# EAGLE design current-sensor (EAGLE 7.1.0)
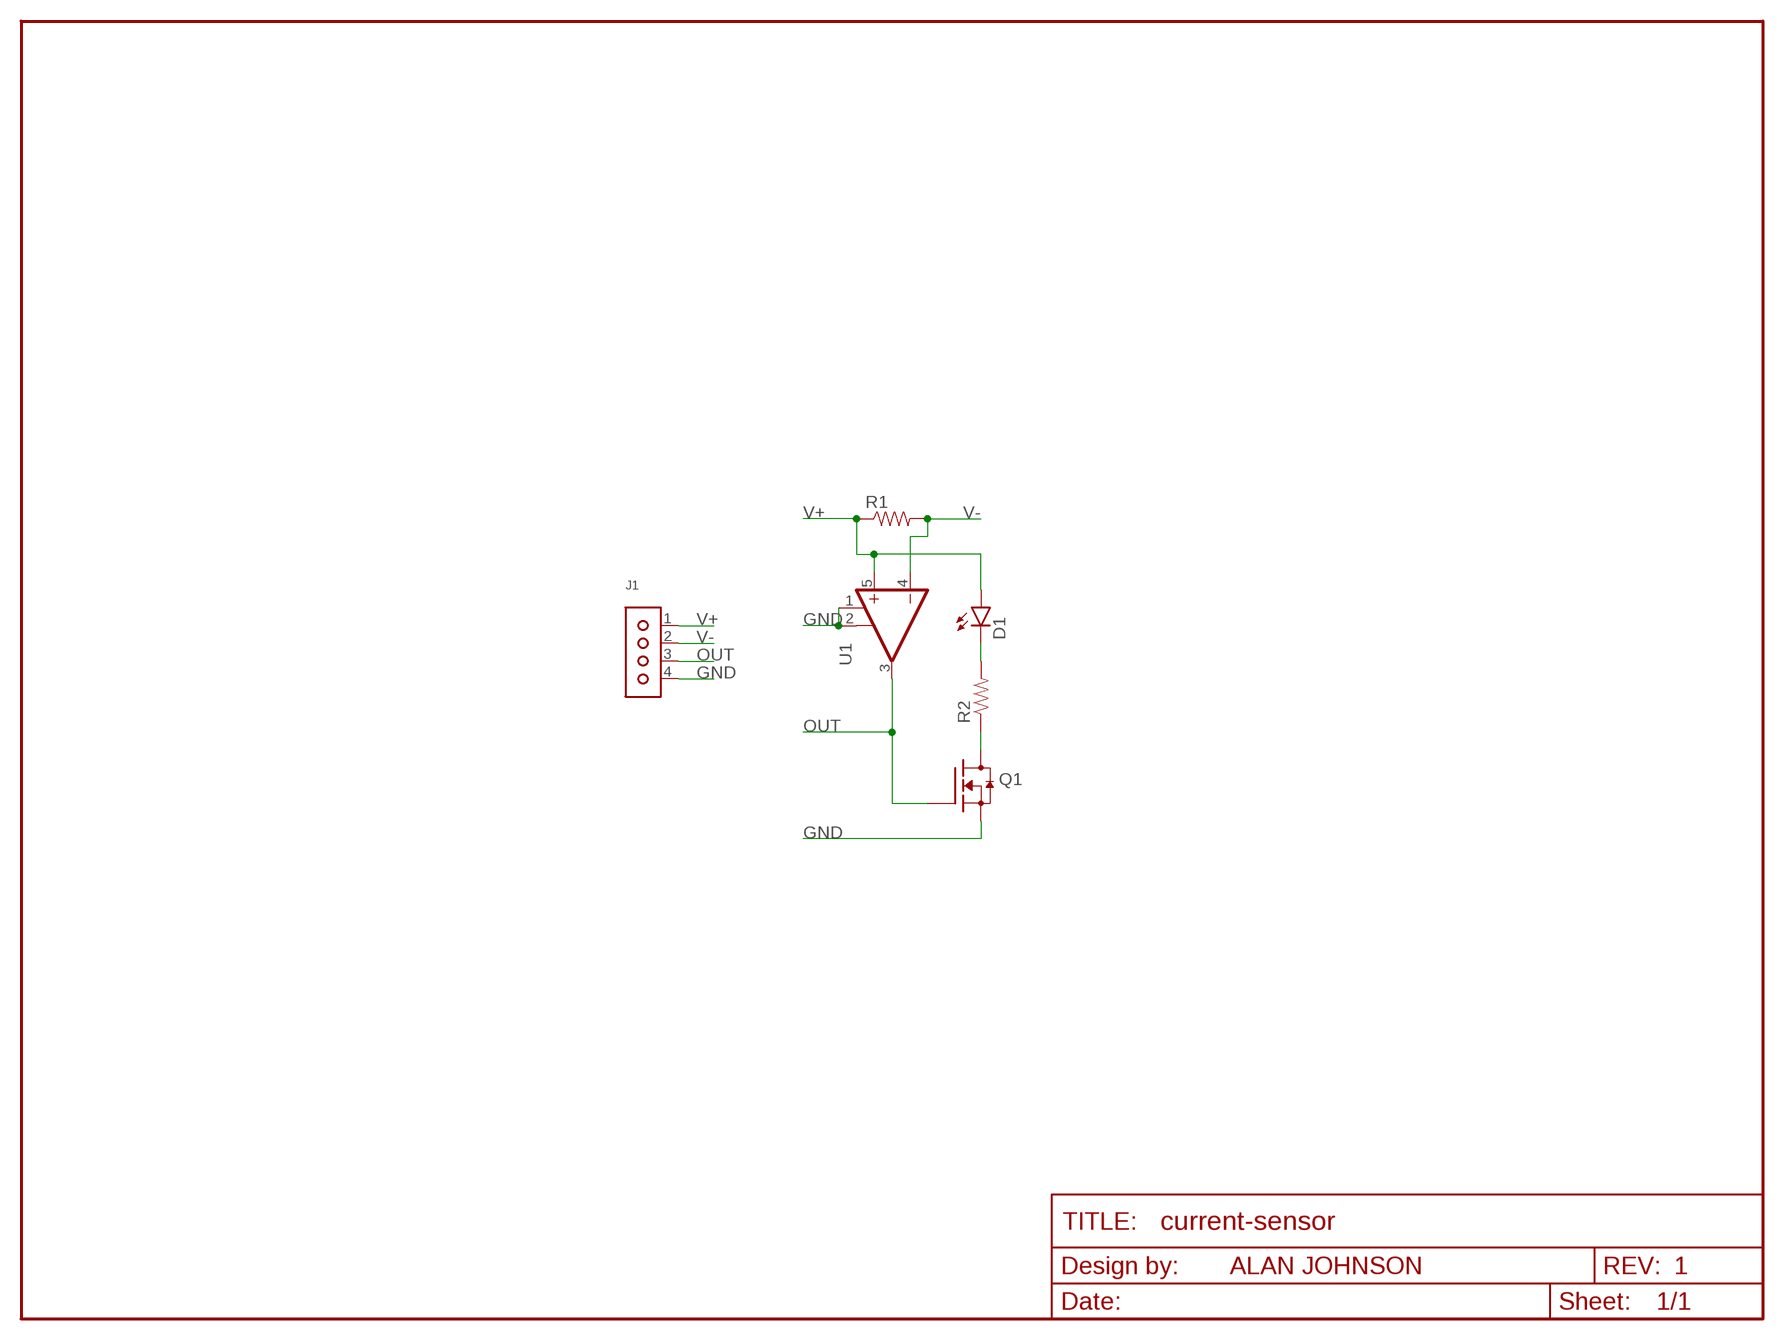
[diagram p0: schematic, sheet 1]

## Parts
D1  LED1206  [LED-1206]
J1  1X04  [1X04]
Q1  AO3416  [SOT23-3]
R1  RESISTOR0805  [0805]
R2  RESISTOR0805  [0805]
U1  TS1102  [SOT23-5]

## Nets
GND: J1.4 Q1.2(S) U1.1(GND) U1.2(GND)
N$2: Q1.3(D) R2.1
N$3: D1.C R2.2
OUT: J1.3 Q1.1(G) U1.3(OUT)
V+: D1.A J1.1 R1.1 U1.5(+IN)
V-: J1.2 R1.2 U1.4(-IN)

## Notes on the sheet
- ALAN JOHNSON | 1

## Library data of the parts
D1 = current-sensor:LED: LED
J1 = current-sensor:1X04: 1x04 Pin Headers
Q1 = current-sensor:AO3416: MOSFET - N Channel 20V Manufacturer Part Number AO3416 <http://aosmd.com/res/data_sheets/AO3416.pdf> DigiKey Part Number 785-1011-1-ND <http://www.digikey.com/product-detail/en/AO3416/785-1011-1-ND/1855953> Datasheet datasheets/AO3416.pdf
R1 R2 = current-sensor:RESISTOR: Resistor
U1 = current-sensor:TS1102: Current Sense OP-AMP Manufacturer Part Number TS1102-XX <http://www.silabs.com/Support%20Documents/TechnicalDocs/TS1102.pdf> DigiKey Part Number TS1102-25EG5TCT-ND <http://www.digikey.com/product-detail/en/TS1102-25EG5T/TS1102-25EG5TCT-ND/3674727> (gain=25) TS1102-50EG5TCT-ND <http://www.digikey.com/product-detail/en/TS1102-50EG5T/TS1102-50EG5TCT-ND/3674728> (gain=50) TS1102-100EG5TCT-ND <http://www.digikey.com/product-detail/en/TS1102-100EG5T/TS1102-100EG5TCT-ND/3674725> (gain=100) TS1102-200EG5TCT-ND <http://www.digikey.com/product-detail/en/TS1102-200EG5T/TS1102-200EG5TCT-ND/3674726> (gain=200) Datasheet datasheets/TS1102.pdf

## Board
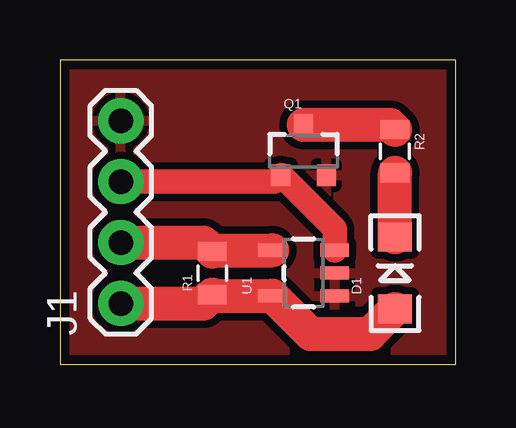
[diagram p1: board, top side]
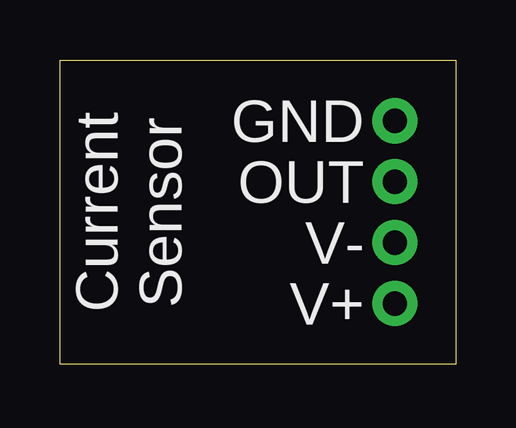
[diagram p2: board, bottom side, seen from below]

Size 16.51 x 12.7 mm. Coordinates in mm from the lower left corner, seen from the top.
Outline: 0,0 16.51,0 16.51,12.7 0,12.7 0,0
Copper layers (1*16): Top 0.0356mm / dielectric 1.5011mm / Bottom 0.0356mm
Design rules "current-sensor *": minimum track width 6mil, minimum drill 13mil, track to track 6mil, track to pad 6mil, pad to pad 6mil, via to via 6mil, smd to smd 6mil, copper to edge 15mil, drill to drill 6mil, minimum pad ring 7mil, minimum via ring 7mil, stop-mask expansion 3mil, vias tented up to drill 0mil, thermal gap 10mil

### Footprints (pad centres in the part's own frame; a part is rotated, then mirrored left to right if it is on the bottom)
LED-1206 = smd 1.2 x 1.4: A -1.5,0; C 1.5,0
1X04 = drill 1.016 pad 1.88: 1 0,0; 2 2.54,0; 3 5.08,0; 4 7.62,0
SOT23-3 = smd 0.8 x 0.9: 1 -0.95,-1; 2 0.95,-1; 3 0,1.1
0805 = smd 0.8 x 1.2: 1 -0.9,0; 2 0.9,0
SOT23-5 = smd 0.55 x 1.2: 1 -0.95,-1.3; 2 0,-1.3; 3 0.95,-1.3; 4 0.95,1.3; 5 -0.95,1.3

### Placement (x,y rotation side)
D1  13.97,3.81 90 top
J1  2.54,2.54 90 top
Q1  10.16,8.89 0 top
R1  6.35,3.81 90 top
R2  13.97,8.89 270 top
U1  10.16,3.81 90 top

### Tracks (layer width: path | path; a pad name or v marks a point on that pad's centre or on a via)
GND
  pour Top (isolate 0.305): 0,0 16.51,0 16.51,12.7 0,12.7
N$2
  Top 1.422: R2.1 13.77,9.99 Q1.3
N$3
  Top 1.422: D1.C R2.2
OUT
  Top 1.016: U1.3 11.46,5.64 Q1.1 8.94,7.62 J1.3
V+
  Top 1.422: J1.1 5.98,2.54 R1.1 6.4,2.86 U1.5 10.45,1.27 12.93,1.27 D1.A
V-
  Top 1.422: J1.2 5.98,5.08 R1.2 6.4,4.76 U1.4

### Text on the board
bPlace: GND | OUT | Current / Sensor | V- | V+